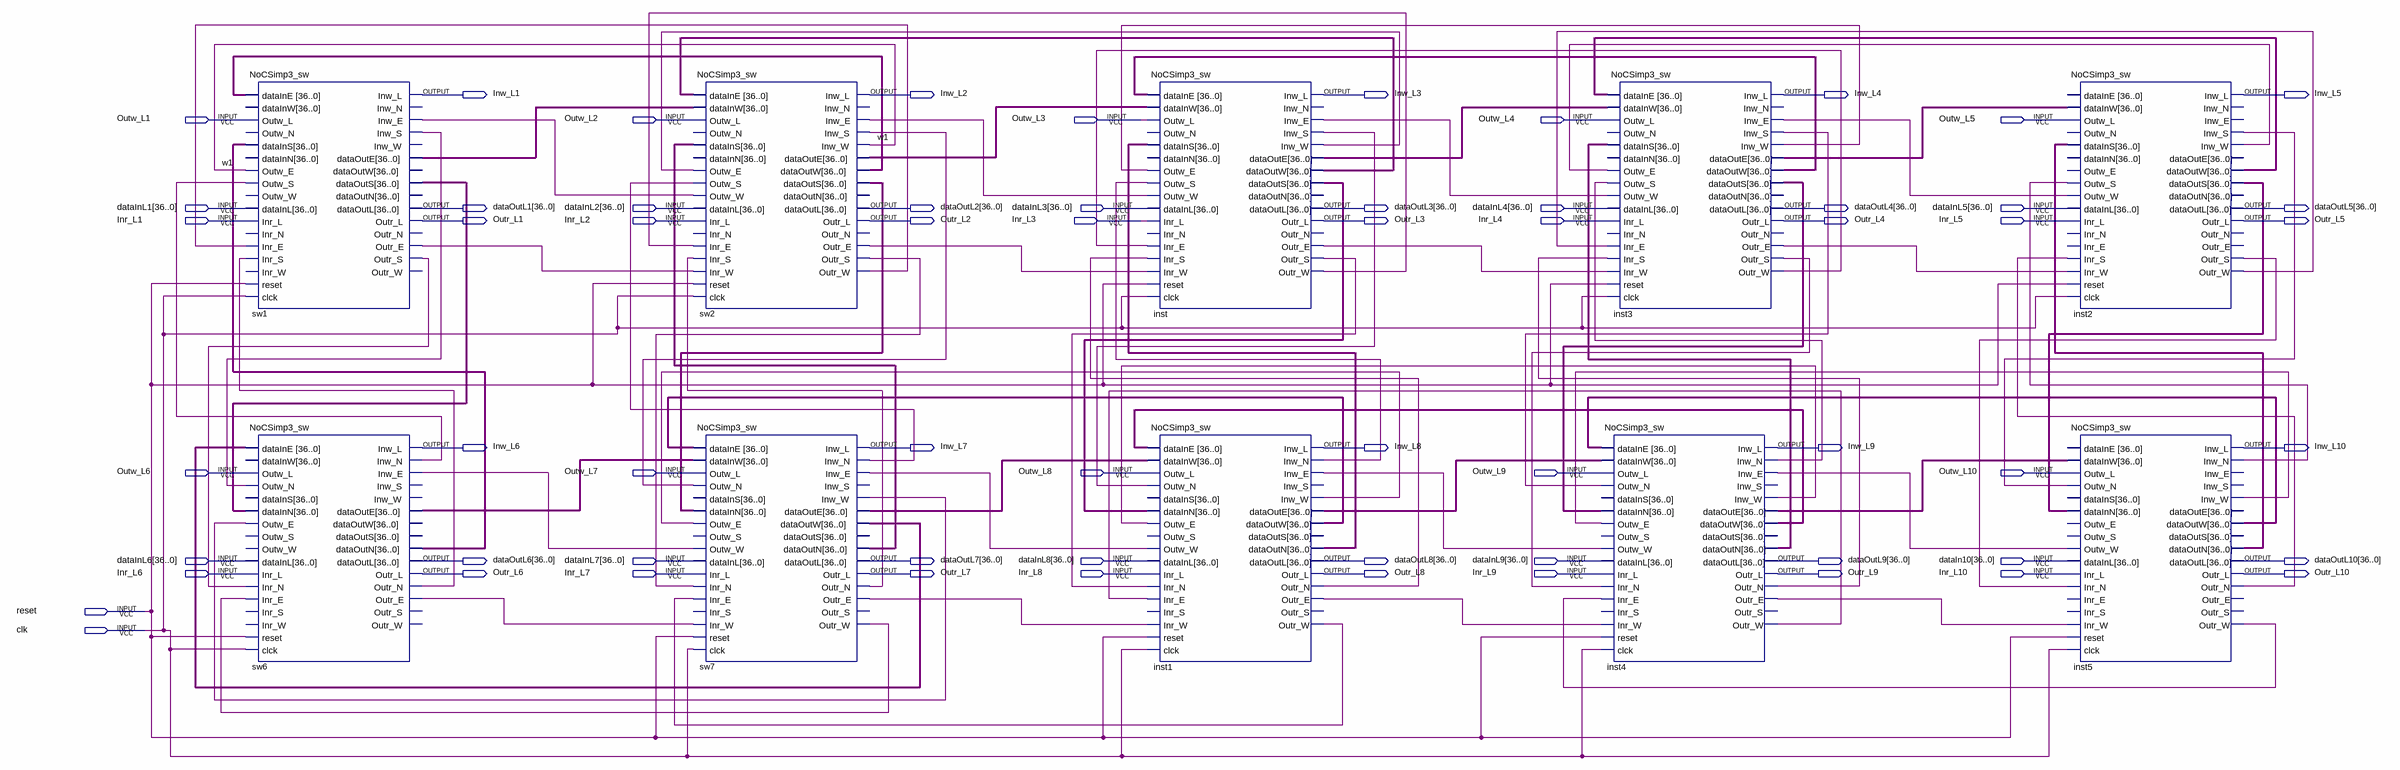
[diagram p0: schematic sheet]
// Quartus schematic 4sw_1.bdf as structural Verilog: 10 symbols, 62 pins
module \4sw_1  (
  input  Outw_L1,
  input  Outw_L2,
  input  Outw_L3,
  input  Outw_L4,
  input  Outw_L5,
  input  [36:0] dataInL1,
  input  [36:0] dataInL2,
  input  [36:0] dataInL3,
  input  [36:0] dataInL4,
  input  [36:0] dataInL5,
  input  Inr_L1,
  input  Inr_L2,
  input  Inr_L3,
  input  Inr_L4,
  input  Inr_L5,
  input  Outw_L6,
  input  Outw_L7,
  input  Outw_L8,
  input  Outw_L9,
  input  Outw_L10,
  input  [36:0] dataInL6,
  input  [36:0] dataInL7,
  input  [36:0] dataInL8,
  input  [36:0] dataInL9,
  input  [36:0] dataIn10,
  input  Inr_L6,
  input  Inr_L7,
  input  Inr_L8,
  input  Inr_L9,
  input  Inr_L10,
  input  reset,
  input  clk,
  output Inw_L1,
  output Inw_L2,
  output Inw_L3,
  output Inw_L4,
  output Inw_L5,
  output [36:0] dataOutL1,
  output [36:0] dataOutL2,
  output [36:0] dataOutL3,
  output [36:0] dataOutL4,
  output [36:0] dataOutL5,
  output Outr_L1,
  output Outr_L2,
  output Outr_L3,
  output Outr_L4,
  output Outr_L5,
  output Inw_L6,
  output Inw_L7,
  output Inw_L8,
  output Inw_L9,
  output Inw_L10,
  output [36:0] dataOutL6,
  output [36:0] dataOutL7,
  output [36:0] dataOutL8,
  output [36:0] dataOutL9,
  output [36:0] dataOutL10,
  output Outr_L6,
  output Outr_L7,
  output Outr_L8,
  output Outr_L9,
  output Outr_L10
);

  wire inst1_inw_e, inst1_inw_n, inst1_inw_w, inst1_outr_e, inst1_outr_n, inst1_outr_w, inst2_inw_s,
       inst2_inw_w, inst2_outr_s, inst2_outr_w, inst3_inw_e, inst3_inw_s, inst3_inw_w, inst3_outr_e,
       inst3_outr_s, inst3_outr_w, inst4_inw_e, inst4_inw_n, inst4_inw_w, inst4_outr_e, inst4_outr_n,
       inst4_outr_w, inst5_inw_n, inst5_inw_w, inst5_outr_n, inst5_outr_w, inst_inw_e, inst_inw_s,
       inst_inw_w, inst_outr_e, inst_outr_s, inst_outr_w, sw1_inw_e, sw1_inw_s, sw1_outr_e, sw1_outr_s,
       sw2_inw_e, sw2_inw_s, sw2_outr_e, sw2_outr_s, sw2_outr_w, sw6_inw_e, sw6_inw_n, sw6_outr_e,
       sw6_outr_n, sw7_inw_e, sw7_inw_n, sw7_inw_w, sw7_outr_e, sw7_outr_n, sw7_outr_w, w1;
  wire [36:0] inst1_dataoute, inst1_dataoutn, inst1_dataoutw, inst2_dataouts, inst2_dataoutw, inst3_dataoute,
       inst3_dataouts, inst3_dataoutw, inst4_dataoute, inst4_dataoutn, inst4_dataoutw, inst5_dataoutn,
       inst5_dataoutw, inst_dataoute, inst_dataouts, inst_dataoutw, sw1_dataoute, sw1_dataouts, sw2_dataoute,
       sw2_dataouts, sw2_dataoutw, sw6_dataoute, sw6_dataoutn, sw7_dataoute, sw7_dataoutn, sw7_dataoutw;

  NoCSimp3_sw sw1 (
    .dataInE(sw2_dataoutw), .Outw_L(Outw_L1), .dataInS(sw6_dataoutn), .Outw_E(w1), .Outw_S(sw6_inw_n),
    .dataInL(dataInL1), .Inr_L(Inr_L1), .Inr_E(sw2_outr_w), .Inr_S(sw6_outr_n), .reset(reset), .clck(clk),
    .Inw_L(Inw_L1), .Inw_E(sw1_inw_e), .Inw_S(sw1_inw_s), .dataOutE(sw1_dataoute), .dataOutS(sw1_dataouts),
    .dataOutL(dataOutL1), .Outr_L(Outr_L1), .Outr_E(sw1_outr_e), .Outr_S(sw1_outr_s));  // open: dataInW, Outw_N, dataInN, Outw_W, Inr_N, Inr_W, Inw_N, Inw_W, dataOutW, dataOutN, Outr_N, Outr_W
  NoCSimp3_sw sw6 (
    .dataInE(sw7_dataoutw), .Outw_L(Outw_L6), .Outw_N(sw1_inw_s), .dataInN(sw1_dataouts), .Outw_E(sw7_inw_w),
    .dataInL(dataInL6), .Inr_L(Inr_L6), .Inr_N(sw1_outr_s), .Inr_E(sw7_outr_w), .reset(reset), .clck(clk),
    .Inw_L(Inw_L6), .Inw_N(sw6_inw_n), .Inw_E(sw6_inw_e), .dataOutE(sw6_dataoute), .dataOutN(sw6_dataoutn),
    .dataOutL(dataOutL6), .Outr_L(Outr_L6), .Outr_N(sw6_outr_n), .Outr_E(sw6_outr_e));  // open: dataInW, dataInS, Outw_S, Outw_W, Inr_S, Inr_W, Inw_S, Inw_W, dataOutW, dataOutS, Outr_S, Outr_W
  NoCSimp3_sw sw2 (
    .dataInE(inst_dataoutw), .dataInW(sw1_dataoute), .Outw_L(Outw_L2), .dataInS(sw7_dataoutn),
    .Outw_E(inst_inw_w), .Outw_S(sw7_inw_n), .Outw_W(sw1_inw_e), .dataInL(dataInL2), .Inr_L(Inr_L2),
    .Inr_E(inst_outr_w), .Inr_S(sw7_outr_n), .Inr_W(sw1_outr_e), .reset(reset), .clck(clk), .Inw_L(Inw_L2),
    .Inw_E(sw2_inw_e), .Inw_S(sw2_inw_s), .Inw_W(w1), .dataOutE(sw2_dataoute), .dataOutW(sw2_dataoutw),
    .dataOutS(sw2_dataouts), .dataOutL(dataOutL2), .Outr_L(Outr_L2), .Outr_E(sw2_outr_e),
    .Outr_S(sw2_outr_s), .Outr_W(sw2_outr_w));  // open: Outw_N, dataInN, Inr_N, Inw_N, dataOutN, Outr_N
  NoCSimp3_sw sw7 (
    .dataInE(inst1_dataoutw), .dataInW(sw6_dataoute), .Outw_L(Outw_L7), .Outw_N(sw2_inw_s),
    .dataInN(sw2_dataouts), .Outw_E(inst1_inw_w), .Outw_W(sw6_inw_e), .dataInL(dataInL7), .Inr_L(Inr_L7),
    .Inr_N(sw2_outr_s), .Inr_E(inst1_outr_w), .Inr_W(sw6_outr_e), .reset(reset), .clck(clk), .Inw_L(Inw_L7),
    .Inw_N(sw7_inw_n), .Inw_E(sw7_inw_e), .Inw_W(sw7_inw_w), .dataOutE(sw7_dataoute),
    .dataOutW(sw7_dataoutw), .dataOutN(sw7_dataoutn), .dataOutL(dataOutL7), .Outr_L(Outr_L7),
    .Outr_N(sw7_outr_n), .Outr_E(sw7_outr_e), .Outr_W(sw7_outr_w));  // open: dataInS, Outw_S, Inr_S, Inw_S, dataOutS, Outr_S
  NoCSimp3_sw inst (
    .dataInE(inst3_dataoutw), .dataInW(sw2_dataoute), .Outw_L(Outw_L3), .dataInS(inst1_dataoutn),
    .Outw_E(inst3_inw_w), .Outw_S(inst1_inw_n), .Outw_W(sw2_inw_e), .dataInL(dataInL3), .Inr_L(Inr_L3),
    .Inr_E(inst3_outr_w), .Inr_S(inst1_outr_n), .Inr_W(sw2_outr_e), .reset(reset), .clck(clk),
    .Inw_L(Inw_L3), .Inw_E(inst_inw_e), .Inw_S(inst_inw_s), .Inw_W(inst_inw_w), .dataOutE(inst_dataoute),
    .dataOutW(inst_dataoutw), .dataOutS(inst_dataouts), .dataOutL(dataOutL3), .Outr_L(Outr_L3),
    .Outr_E(inst_outr_e), .Outr_S(inst_outr_s), .Outr_W(inst_outr_w));  // open: Outw_N, dataInN, Inr_N, Inw_N, dataOutN, Outr_N
  NoCSimp3_sw inst1 (
    .dataInE(inst4_dataoutw), .dataInW(sw7_dataoute), .Outw_L(Outw_L8), .Outw_N(inst_inw_s),
    .dataInN(inst_dataouts), .Outw_E(inst4_inw_w), .Outw_W(sw7_inw_e), .dataInL(dataInL8), .Inr_L(Inr_L8),
    .Inr_N(inst_outr_s), .Inr_E(inst4_outr_w), .Inr_W(sw7_outr_e), .reset(reset), .clck(clk), .Inw_L(Inw_L8),
    .Inw_N(inst1_inw_n), .Inw_E(inst1_inw_e), .Inw_W(inst1_inw_w), .dataOutE(inst1_dataoute),
    .dataOutW(inst1_dataoutw), .dataOutN(inst1_dataoutn), .dataOutL(dataOutL8), .Outr_L(Outr_L8),
    .Outr_N(inst1_outr_n), .Outr_E(inst1_outr_e), .Outr_W(inst1_outr_w));  // open: dataInS, Outw_S, Inr_S, Inw_S, dataOutS, Outr_S
  NoCSimp3_sw inst3 (
    .dataInE(inst2_dataoutw), .dataInW(inst_dataoute), .Outw_L(Outw_L4), .dataInS(inst4_dataoutn),
    .Outw_E(inst2_inw_w), .Outw_S(inst4_inw_n), .Outw_W(inst_inw_e), .dataInL(dataInL4), .Inr_L(Inr_L4),
    .Inr_E(inst2_outr_w), .Inr_S(inst4_outr_n), .Inr_W(inst_outr_e), .reset(reset), .clck(clk),
    .Inw_L(Inw_L4), .Inw_E(inst3_inw_e), .Inw_S(inst3_inw_s), .Inw_W(inst3_inw_w), .dataOutE(inst3_dataoute),
    .dataOutW(inst3_dataoutw), .dataOutS(inst3_dataouts), .dataOutL(dataOutL4), .Outr_L(Outr_L4),
    .Outr_E(inst3_outr_e), .Outr_S(inst3_outr_s), .Outr_W(inst3_outr_w));  // open: Outw_N, dataInN, Inr_N, Inw_N, dataOutN, Outr_N
  NoCSimp3_sw inst4 (
    .dataInE(inst5_dataoutw), .dataInW(inst1_dataoute), .Outw_L(Outw_L9), .Outw_N(inst3_inw_s),
    .dataInN(inst3_dataouts), .Outw_E(inst5_inw_w), .Outw_W(inst1_inw_e), .dataInL(dataInL9), .Inr_L(Inr_L9),
    .Inr_N(inst3_outr_s), .Inr_E(inst5_outr_w), .Inr_W(inst1_outr_e), .reset(reset), .clck(clk),
    .Inw_L(Inw_L9), .Inw_N(inst4_inw_n), .Inw_E(inst4_inw_e), .Inw_W(inst4_inw_w), .dataOutE(inst4_dataoute),
    .dataOutW(inst4_dataoutw), .dataOutN(inst4_dataoutn), .dataOutL(dataOutL9), .Outr_L(Outr_L9),
    .Outr_N(inst4_outr_n), .Outr_E(inst4_outr_e), .Outr_W(inst4_outr_w));  // open: dataInS, Outw_S, Inr_S, Inw_S, dataOutS, Outr_S
  NoCSimp3_sw inst2 (
    .dataInW(inst3_dataoute), .Outw_L(Outw_L5), .dataInS(inst5_dataoutn), .Outw_S(inst5_inw_n),
    .Outw_W(inst3_inw_e), .dataInL(dataInL5), .Inr_L(Inr_L5), .Inr_S(inst5_outr_n), .Inr_W(inst3_outr_e),
    .reset(reset), .clck(clk), .Inw_L(Inw_L5), .Inw_S(inst2_inw_s), .Inw_W(inst2_inw_w),
    .dataOutW(inst2_dataoutw), .dataOutS(inst2_dataouts), .dataOutL(dataOutL5), .Outr_L(Outr_L5),
    .Outr_S(inst2_outr_s), .Outr_W(inst2_outr_w));  // open: dataInE, Outw_N, dataInN, Outw_E, Inr_N, Inr_E, Inw_N, Inw_E, dataOutE, dataOutN, Outr_N, Outr_E
  NoCSimp3_sw inst5 (
    .dataInW(inst4_dataoute), .Outw_L(Outw_L10), .Outw_N(inst2_inw_s), .dataInN(inst2_dataouts),
    .Outw_W(inst4_inw_e), .dataInL(dataIn10), .Inr_L(Inr_L10), .Inr_N(inst2_outr_s), .Inr_W(inst4_outr_e),
    .reset(reset), .clck(clk), .Inw_L(Inw_L10), .Inw_N(inst5_inw_n), .Inw_W(inst5_inw_w),
    .dataOutW(inst5_dataoutw), .dataOutN(inst5_dataoutn), .dataOutL(dataOutL10), .Outr_L(Outr_L10),
    .Outr_N(inst5_outr_n), .Outr_W(inst5_outr_w));  // open: dataInE, dataInS, Outw_E, Outw_S, Inr_E, Inr_S, Inw_E, Inw_S, dataOutE, dataOutS, Outr_E, Outr_S
endmodule
